# Altium schematic sheet fpga_sch.SchDoc: SoPC Oscilloscope - FPGA, Buffers
size C; Author: Santiago Navonne; DrawnBy: Santiago Navonne; Revision: 1.1; SheetNumber: 1; SheetTotal: 5
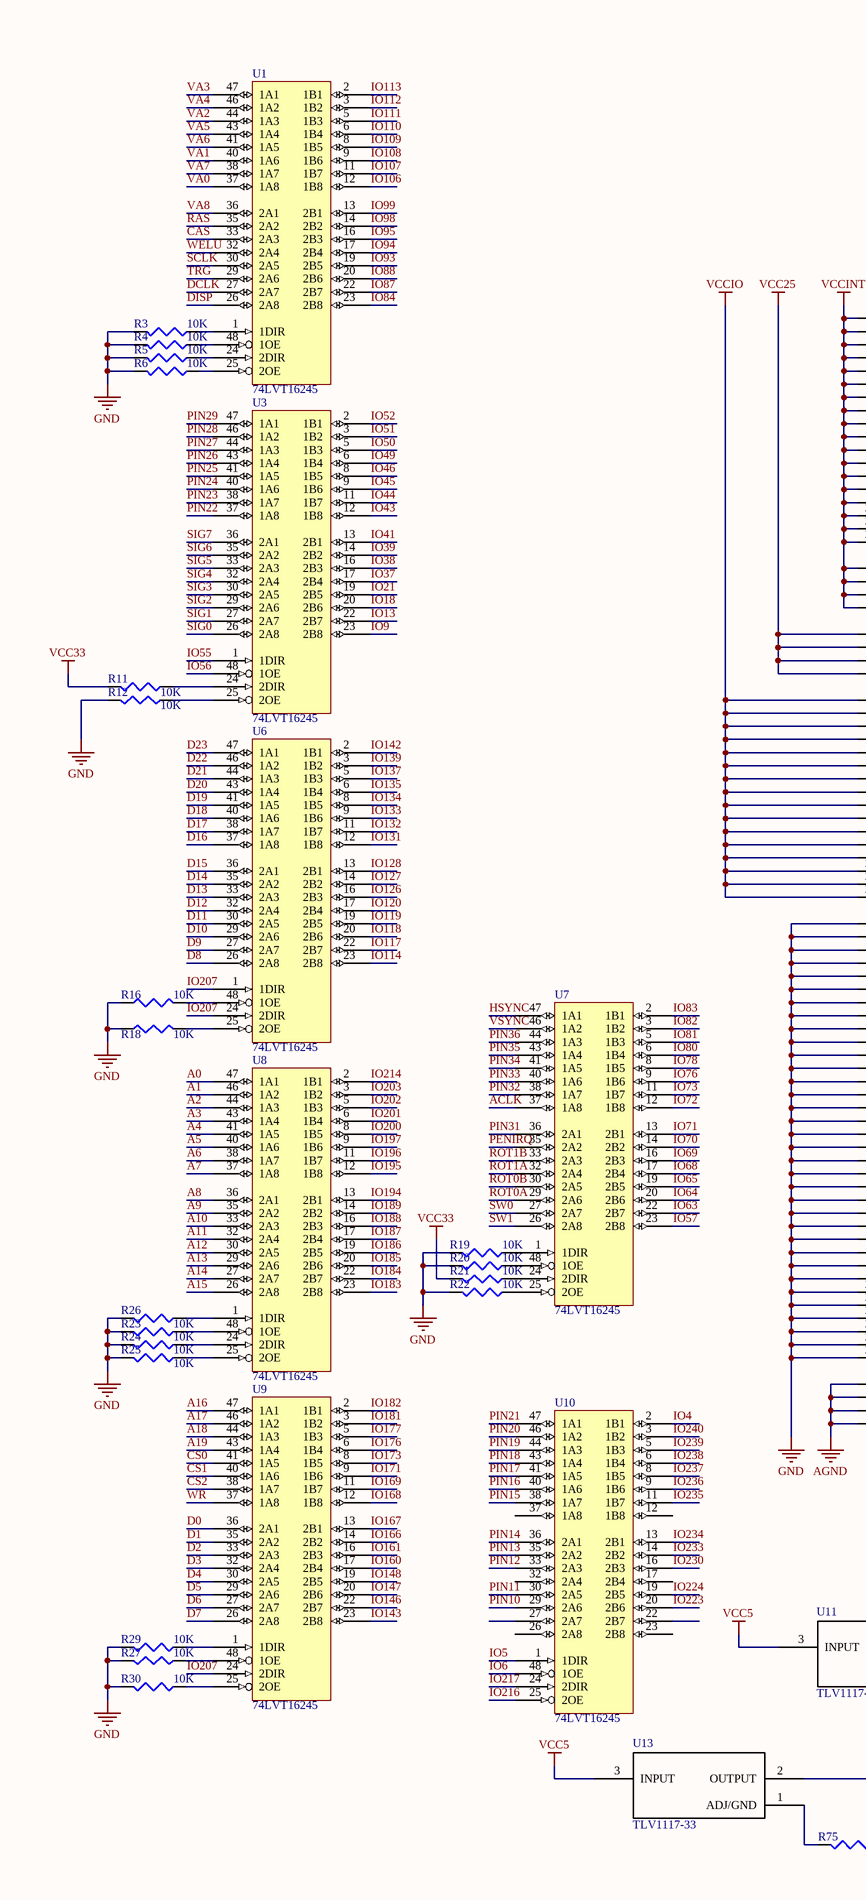
[diagram p0: fpga_sch.SchDoc, left]
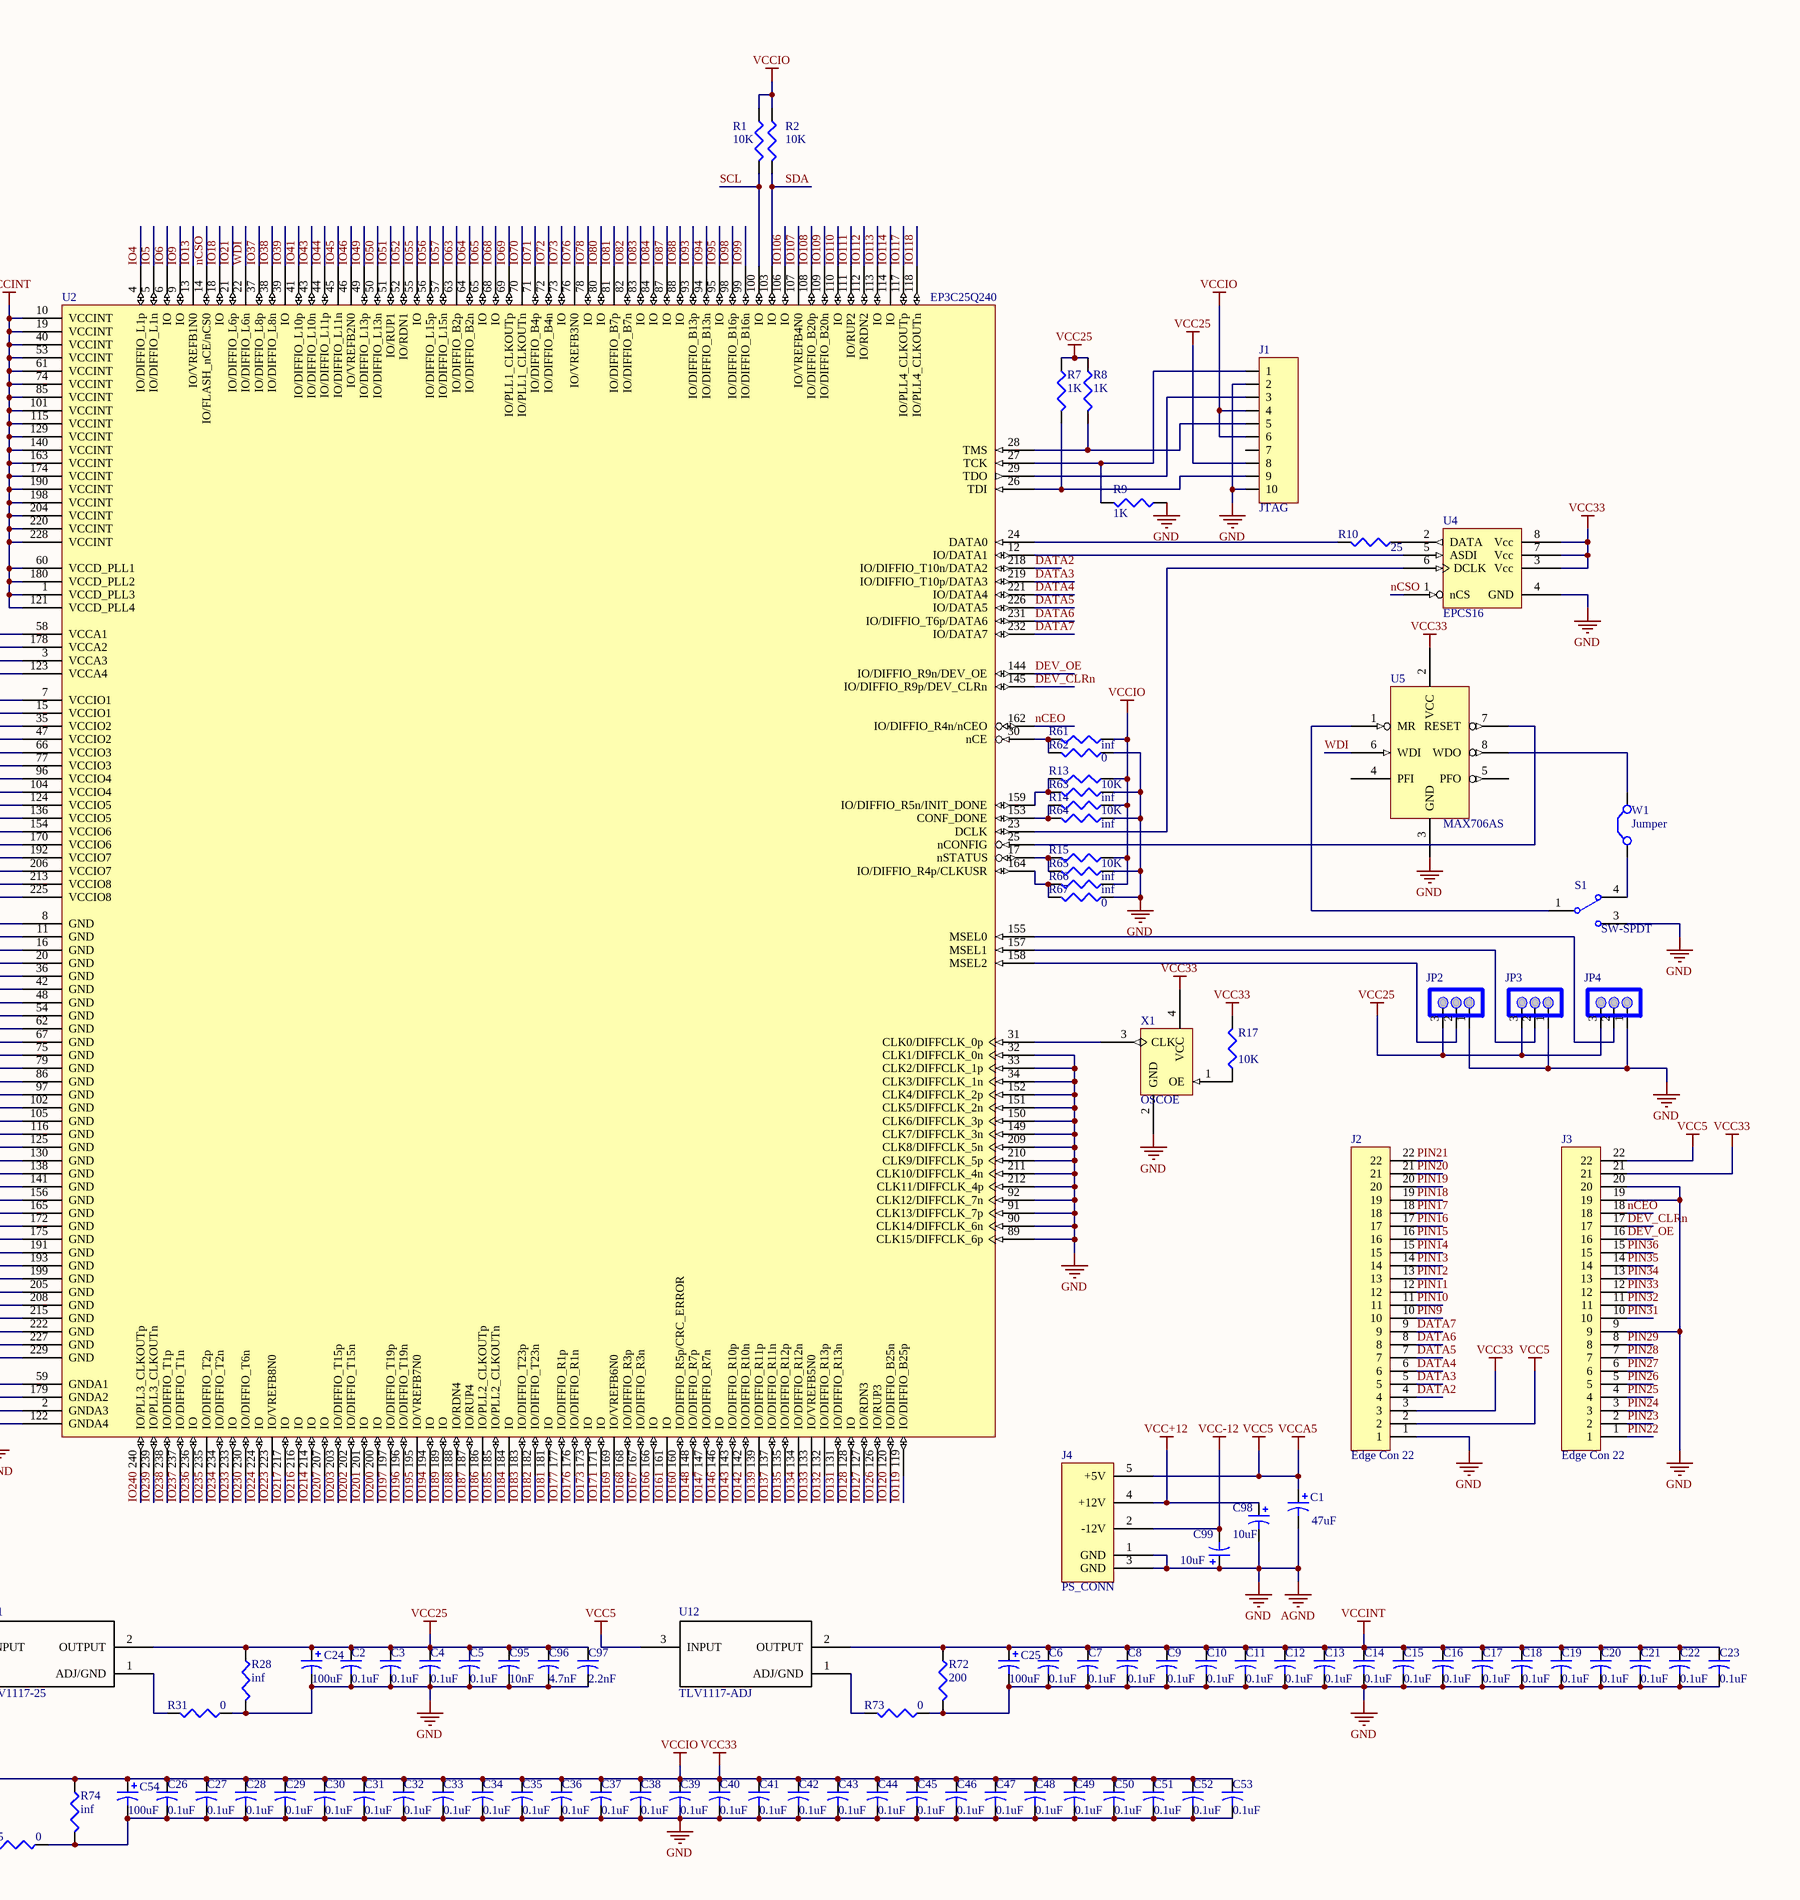
[diagram p1: fpga_sch.SchDoc, right]

## Parts
C1  value 47uF  [CAPC3216N]  (hidden comment: Cap Pol1)
C2  value 0.1uF  [CAPC1608L]  (hidden comment: Cap2)
C3  value 0.1uF  [CAPC1608L]  (hidden comment: Cap2)
C4  value 0.1uF  [CAPC1608L]  (hidden comment: Cap2)
C5  value 0.1uF  [CAPC1608L]  (hidden comment: Cap2)
C6  value 0.1uF  [CAPC1608L]  (hidden comment: Cap2)
C7  value 0.1uF  [CAPC1608L]  (hidden comment: Cap2)
C8  value 0.1uF  [CAPC1608L]  (hidden comment: Cap2)
C9  value 0.1uF  [CAPC1608L]  (hidden comment: Cap2)
C10  value 0.1uF  [CAPC1608L]  (hidden comment: Cap2)
C11  value 0.1uF  [CAPC1608L]  (hidden comment: Cap2)
C12  value 0.1uF  [CAPC1608L]  (hidden comment: Cap2)
C13  value 0.1uF  [CAPC1608L]  (hidden comment: Cap2)
C14  value 0.1uF  [CAPC1608L]  (hidden comment: Cap2)
C15  value 0.1uF  [CAPC1608L]  (hidden comment: Cap2)
C16  value 0.1uF  [CAPC1608L]  (hidden comment: Cap2)
C17  value 0.1uF  [CAPC1608L]  (hidden comment: Cap2)
C18  value 0.1uF  [CAPC1608L]  (hidden comment: Cap2)
C19  value 0.1uF  [CAPC1608L]  (hidden comment: Cap2)
C20  value 0.1uF  [CAPC1608L]  (hidden comment: Cap2)
C21  value 0.1uF  [CAPC1608L]  (hidden comment: Cap2)
C22  value 0.1uF  [CAPC1608L]  (hidden comment: Cap2)
C23  value 0.1uF  [CAPC1608L]  (hidden comment: Cap2)
C24  value 100uF  [C2917]  (hidden comment: Cap Pol3)
C25  value 100uF  [C2917]  (hidden comment: Cap Pol3)
C26  value 0.1uF  [CAPC1608L]  (hidden comment: Cap2)
C27  value 0.1uF  [CAPC1608L]  (hidden comment: Cap2)
C28  value 0.1uF  [CAPC1608L]  (hidden comment: Cap2)
C29  value 0.1uF  [CAPC1608L]  (hidden comment: Cap2)
C30  value 0.1uF  [CAPC1608L]  (hidden comment: Cap2)
C31  value 0.1uF  [CAPC1608L]  (hidden comment: Cap2)
C32  value 0.1uF  [CAPC1608L]  (hidden comment: Cap2)
C33  value 0.1uF  [CAPC1608L]  (hidden comment: Cap2)
C34  value 0.1uF  [CAPC1608L]  (hidden comment: Cap2)
C35  value 0.1uF  [CAPC1608L]  (hidden comment: Cap2)
C36  value 0.1uF  [CAPC1608L]  (hidden comment: Cap2)
C37  value 0.1uF  [CAPC1608L]  (hidden comment: Cap2)
C38  value 0.1uF  [CAPC1608L]  (hidden comment: Cap2)
C39  value 0.1uF  [CAPC1608L]  (hidden comment: Cap2)
C40  value 0.1uF  [CAPC1608L]  (hidden comment: Cap2)
C41  value 0.1uF  [CAPC1608L]  (hidden comment: Cap2)
C42  value 0.1uF  [CAPC1608L]  (hidden comment: Cap2)
C43  value 0.1uF  [CAPC1608L]  (hidden comment: Cap2)
C44  value 0.1uF  [CAPC1608L]  (hidden comment: Cap2)
C45  value 0.1uF  [CAPC1608L]  (hidden comment: Cap2)
C46  value 0.1uF  [CAPC1608L]  (hidden comment: Cap2)
C47  value 0.1uF  [CAPC1608L]  (hidden comment: Cap2)
C48  value 0.1uF  [CAPC1608L]  (hidden comment: Cap2)
C49  value 0.1uF  [CAPC1608L]  (hidden comment: Cap2)
C50  value 0.1uF  [CAPC1608L]  (hidden comment: Cap2)
C51  value 0.1uF  [CAPC1608L]  (hidden comment: Cap2)
C52  value 0.1uF  [CAPC1608L]  (hidden comment: Cap2)
C53  value 0.1uF  [CAPC1608L]  (hidden comment: Cap2)
C54  value 100uF  [C2917]  (hidden comment: Cap Pol3)
C95  value 10nF  [CAPC1608L]  (hidden comment: Cap2)
C96  value 4.7nF  [CAPC1608L]  (hidden comment: Cap2)
C97  value 2.2nF  [CAPC1608L]  (hidden comment: Cap2)
C98  value 10uF  [CAPC3216N]  (hidden comment: Cap Pol1)
C99  value 10uF  [CAPC3216N]  (hidden comment: Cap Pol1)
J1  JTAG  [SIP2X5]
J2  Edge Con 22  [PIN22]
J3  Edge Con 22  [PIN22]
J4  PS_CONN  [DIN5]
JP2  MSEL2  [HDR1X3]  (value not drawn)
JP3  MSEL1  [HDR1X3]  (value not drawn)
JP4  MSEL0  [HDR1X3]  (value not drawn)
R1  value 10K  [RESC1608N]  (hidden comment: Res3)
R2  value 10K  [RESC1608N]  (hidden comment: Res3)
R3  value 10K  [RESC1608N]  (hidden comment: Res3)
R4  value 10K  [RESC1608N]  (hidden comment: Res3)
R5  value 10K  [RESC1608N]  (hidden comment: Res3)
R6  value 10K  [RESC1608N]  (hidden comment: Res3)
R7  value 1K  [RESC1608N]  (hidden comment: Res3)
R8  value 1K  [RESC1608N]  (hidden comment: Res3)
R9  value 1K  [RESC1608N]  (hidden comment: Res3)
R10  value 25  [RESC1608N]  (hidden comment: Res3)
R11  value 10K  [RESC1608N]  (hidden comment: Res3)
R12  value 10K  [RESC1608N]  (hidden comment: Res3)
R13  value 10K  [RESC1608N]  (hidden comment: Res3)
R14  value 10K  [RESC1608N]  (hidden comment: Res3)
R15  value 10K  [RESC1608N]  (hidden comment: Res3)
R16  value 10K  [RESC1608N]  (hidden comment: Res3)
R17  value 10K  [RESC1608N]  (hidden comment: Res3)
R18  value 10K  [RESC1608N]  (hidden comment: Res3)
R19  value 10K  [RESC1608N]  (hidden comment: Res3)
R20  value 10K  [RESC1608N]  (hidden comment: Res3)
R21  value 10K  [RESC1608N]  (hidden comment: Res3)
R22  value 10K  [RESC1608N]  (hidden comment: Res3)
R23  value 10K  [RESC1608N]  (hidden comment: Res3)
R24  value 10K  [RESC1608N]  (hidden comment: Res3)
R25  value 10K  [RESC1608N]  (hidden comment: Res3)
R26  value 10K  [RESC1608N]  (hidden comment: Res3)
R27  value 10K  [RESC1608N]  (hidden comment: Res3)
R28  value inf  [RESC1608N]  (hidden comment: Res3)
R29  value 10K  [RESC1608N]  (hidden comment: Res3)
R30  value 10K  [RESC1608N]  (hidden comment: Res3)
R31  value 0  [RESC1608N]  (hidden comment: Res3)
R61  value inf  [RESC1608N]  (hidden comment: Res3)
R62  value 0  [RESC1608N]  (hidden comment: Res3)
R63  value inf  [RESC1608N]  (hidden comment: Res3)
R64  value inf  [RESC1608N]  (hidden comment: Res3)
R65  value inf  [RESC1608N]  (hidden comment: Res3)
R66  value inf  [RESC1608N]  (hidden comment: Res3)
R67  value 0  [RESC1608N]  (hidden comment: Res3)
R72  value 200  [RESC1608N]  (hidden comment: Res3)
R73  value 0  [RESC1608N]  (hidden comment: Res3)
R74  value inf  [RESC1608N]  (hidden comment: Res3)
R75  value 0  [RESC1608N]  (hidden comment: Res3)
S1  SW-SPDT  [SPDT]
U1  74LVT16245  [TSSOP48]
U2  EP3C25Q240  [PQFP240]
U3  74LVT16245  [TSSOP48]
U4  EPCS16  [SO-8]
U5  MAX706AS  [DIP8]
U6  74LVT16245  [TSSOP48]
U7  74LVT16245  [TSSOP48]
U8  74LVT16245  [TSSOP48]
U9  74LVT16245  [TSSOP48]
U10  74LVT16245  [TSSOP48]
U11  TLV1117-25  [KVU3]
U12  TLV1117-ADJ  [KVU3]
U13  TLV1117-33  [KVU3]
W1  Jumper  [SIP2]
X1  OSCOE  [SG636PCE]

## Nets
AGND: C1.2 C2.2 C3.2 C4.2 C5.2 C6.2 C7.2 C8.2 C9.2 C10.2 C11.2 C12.2 C13.2 C14.2 C15.2 C16.2 C17.2 C18.2 C19.2 C20.2 C21.2 C22.2 C23.2 C24.2 C25.2 C26.2 C27.2 C28.2 C29.2 C30.2 C31.2 C32.2 C33.2 C34.2 C35.2 C36.2 C37.2 C38.2 C39.2 C40.2 C41.2 C42.2 C43.2 C44.2 C45.2 C46.2 C47.2 C48.2 C49.2 C50.2 C51.2 C52.2 C53.2 C54.2 C95.2 C96.2 C97.2 C98.2 C99.1 J1.2 J1.10 J2.1 J3.9 J3.19 J3.20 J4.1(GND) J4.3(GND) JP2.1(J1) JP3.1(J1) JP4.1(J1) R3.2 R4.2 R5.2 R6.2 R9.1 R12.2 R16.1 R18.1 R19.2 R20.2 R22.2 R23.2 R24.2 R25.2 R26.2 R27.2 R28.2 R29.2 R30.2 R31.1 R62.1 R63.1 R64.1 R65.1 R67.1 R72.2 R73.1 R74.2 R75.1 S1.3 U1.4(GND) U1.10(GND) U1.15(GND) U1.21(GND) U1.28(GND) U1.34(GND) U1.39(GND) U1.45(GND) U2.2(GNDA3) U2.8(GND) U2.11(GND) U2.16(GND) U2.20(GND) U2.32(CLK1/DIFFCLK_0n) U2.33(CLK2/DIFFCLK_1p) U2.34(CLK3/DIFFCLK_1n) U2.36(GND) U2.42(GND) U2.48(GND) U2.54(GND) U2.59(GNDA1) U2.62(GND) U2.67(GND) U2.75(GND) U2.79(GND) U2.86(GND) U2.89(CLK15/DIFFCLK_6p) U2.90(CLK14/DIFFCLK_6n) U2.91(CLK13/DIFFCLK_7p) U2.92(CLK12/DIFFCLK_7n) U2.97(GND) U2.102(GND) U2.105(GND) U2.116(GND) U2.122(GNDA4) U2.125(GND) U2.130(GND) U2.138(GND) U2.141(GND) U2.149(CLK7/DIFFCLK_3n) U2.150(CLK6/DIFFCLK_3p) U2.151(CLK5/DIFFCLK_2n) U2.152(CLK4/DIFFCLK_2p) U2.156(GND) U2.165(GND) U2.172(GND) U2.175(GND) U2.179(GNDA2) U2.191(GND) U2.193(GND) U2.199(GND) U2.205(GND) U2.208(GND) U2.209(CLK8/DIFFCLK_5n) U2.210(CLK9/DIFFCLK_5p) U2.211(CLK10/DIFFCLK_4n) U2.212(CLK11/DIFFCLK_4p) U2.215(GND) U2.222(GND) U2.227(GND) U2.229(GND) U3.4(GND) U3.10(GND) U3.15(GND) U3.21(GND) U3.28(GND) U3.34(GND) U3.39(GND) U3.45(GND) U4.4(GND) U5.3(GND) U6.4(GND) U6.10(GND) U6.15(GND) U6.21(GND) U6.28(GND) U6.34(GND) U6.39(GND) U6.45(GND) U7.4(GND) U7.10(GND) U7.15(GND) U7.21(GND) U7.28(GND) U7.34(GND) U7.39(GND) U7.45(GND) U8.4(GND) U8.10(GND) U8.15(GND) U8.21(GND) U8.28(GND) U8.34(GND) U8.39(GND) U8.45(GND) U9.4(GND) U9.10(GND) U9.15(GND) U9.21(GND) U9.28(GND) U9.34(GND) U9.39(GND) U9.45(GND) U10.4(GND) U10.10(GND) U10.15(GND) U10.21(GND) U10.28(GND) U10.34(GND) U10.39(GND) U10.45(GND) X1.2(GND)  [also labelled GND]
VCC: C26.1 C27.1 C28.1 C29.1 C30.1 C31.1 C32.1 C33.1 C34.1 C35.1 C36.1 C37.1 C38.1 C39.1 C40.1 C41.1 C42.1 C43.1 C44.1 C45.1 C46.1 C47.1 C48.1 C49.1 C50.1 C51.1 C52.1 C53.1 C54.1 J1.4 J1.6 J2.3 J3.21 R1.1 R2.1 R11.2 R13.1 R14.1 R15.1 R17.2 R21.2 R61.1 R66.1 R74.1 U1.7(Vcc33) U1.18(Vcc33) U1.31(Vcc33) U1.42(Vcc33) U2.7(VCCIO1) U2.15(VCCIO1) U2.35(VCCIO2) U2.47(VCCIO2) U2.66(VCCIO3) U2.77(VCCIO3) U2.96(VCCIO4) U2.104(VCCIO4) U2.124(VCCIO5) U2.136(VCCIO5) U2.154(VCCIO6) U2.170(VCCIO6) U2.192(VCCIO7) U2.206(VCCIO7) U2.213(VCCIO8) U2.225(VCCIO8) U3.7(Vcc33) U3.18(Vcc33) U3.31(Vcc33) U3.42(Vcc33) U4.3(Vcc) U4.7(Vcc) U4.8(Vcc) U5.2(VCC) U6.7(Vcc33) U6.18(Vcc33) U6.31(Vcc33) U6.42(Vcc33) U7.7(Vcc33) U7.18(Vcc33) U7.31(Vcc33) U7.42(Vcc33) U8.7(Vcc33) U8.18(Vcc33) U8.31(Vcc33) U8.42(Vcc33) U9.7(Vcc33) U9.18(Vcc33) U9.31(Vcc33) U9.42(Vcc33) U10.7(Vcc33) U10.18(Vcc33) U10.31(Vcc33) U10.42(Vcc33) U13.2(OUTPUT) X1.4(VCC)  [also labelled VCC33, VCCIO]
VCC5: C1.1 J2.2 J3.22 J4.5(+5V) U11.3(INPUT) U12.3(INPUT) U13.3(INPUT)  [also labelled VCCA5]
VCC25: C2.1 C3.1 C4.1 C5.1 C24.1 C95.1 C96.1 C97.1 J1.8 JP2.3(J3) JP3.3(J3) JP4.3(J3) R7.1 R8.1 R28.1 U2.3(VCCA3) U2.58(VCCA1) U2.123(VCCA4) U2.178(VCCA2) U11.2(OUTPUT)
VCC+12: C98.1 J4.4(+12V)
VCC-12: C99.2 J4.2(-12V)
VCCINT: C6.1 C7.1 C8.1 C9.1 C10.1 C11.1 C12.1 C13.1 C14.1 C15.1 C16.1 C17.1 C18.1 C19.1 C20.1 C21.1 C22.1 C23.1 C25.1 R72.1 U2.1(VCCD_PLL3) U2.10(VCCINT) U2.19(VCCINT) U2.40(VCCINT) U2.53(VCCINT) U2.60(VCCD_PLL1) U2.61(VCCINT) U2.74(VCCINT) U2.85(VCCINT) U2.101(VCCINT) U2.115(VCCINT) U2.121(VCCD_PLL4) U2.129(VCCINT) U2.140(VCCINT) U2.163(VCCINT) U2.174(VCCINT) U2.180(VCCD_PLL2) U2.190(VCCINT) U2.198(VCCINT) U2.204(VCCINT) U2.220(VCCINT) U2.228(VCCINT) U12.2(OUTPUT)
A0: U8.47(1A1)
A1: U8.46(1A2)
A2: U8.44(1A3)
A3: U8.43(1A4)
A4: U8.41(1A5)
A5: U8.40(1A6)
A6: U8.38(1A7)
A7: U8.37(1A8)
A8: U8.36(2A1)
A9: U8.35(2A2)
A10: U8.33(2A3)
A11: U8.32(2A4)
A12: U8.30(2A5)
A13: U8.29(2A6)
A14: U8.27(2A7)
A15: U8.26(2A8)
A16: U9.47(1A1)
A17: U9.46(1A2)
A18: U9.44(1A3)
A19: U9.43(1A4)
ACLK: U7.37(1A8)
CAS: U1.33(2A3)
CS0: U9.41(1A5)
CS1: U9.40(1A6)
CS2: U9.38(1A7)
D0: U9.36(2A1)
D1: U9.35(2A2)
D2: U9.33(2A3)
D3: U9.32(2A4)
D4: U9.30(2A5)
D5: U9.29(2A6)
D6: U9.27(2A7)
D7: U9.26(2A8)
D8: U6.26(2A8)
D9: U6.27(2A7)
D10: U6.29(2A6)
D11: U6.30(2A5)
D12: U6.32(2A4)
D13: U6.33(2A3)
D14: U6.35(2A2)
D15: U6.36(2A1)
D16: U6.37(1A8)
D17: U6.38(1A7)
D18: U6.40(1A6)
D19: U6.41(1A5)
D20: U6.43(1A4)
D21: U6.44(1A3)
D22: U6.46(1A2)
D23: U6.47(1A1)
DATA2: J2.4 U2.218(IO/DIFFIO_T10n/DATA2)
DATA3: J2.5 U2.219(IO/DIFFIO_T10p/DATA3)
DATA4: J2.6 U2.221(IO/DATA4)
DATA5: J2.7 U2.226(IO/DATA5)
DATA6: J2.8 U2.231(IO/DIFFIO_T6p/DATA6)
DATA7: J2.9 U2.232(IO/DATA7)
DCLK: U1.27(2A7)
DEV_CLRn: J3.17 U2.145(IO/DIFFIO_R9p/DEV_CLRn)
DEV_OE: J3.16 U2.144(IO/DIFFIO_R9n/DEV_OE)
DISP: U1.26(2A8)
HSYNC: U7.47(1A1)
IO4: U2.4(IO/DIFFIO_L1p) U10.2(1B1)
IO5: U2.5(IO/DIFFIO_L1n) U10.1(1DIR)
IO6: U2.6(IO) U10.48(1OE)
IO9: U2.9(IO) U3.23(2B8)
IO13: U2.13(IO/VREFB1N0) U3.22(2B7)
IO18: U2.18(IO) U3.20(2B6)
IO21: U2.21(IO/DIFFIO_L6p) U3.19(2B5)
IO37: U2.37(IO/DIFFIO_L8p) U3.17(2B4)
IO38: U2.38(IO/DIFFIO_L8n) U3.16(2B3)
IO39: U2.39(IO) U3.14(2B2)
IO41: U2.41(IO/DIFFIO_L10p) U3.13(2B1)
IO43: U2.43(IO/DIFFIO_L10n) U3.12(1B8)
IO44: U2.44(IO/DIFFIO_L11p) U3.11(1B7)
IO45: U2.45(IO/DIFFIO_L11n) U3.9(1B6)
IO46: U2.46(IO/VREFB2N0) U3.8(1B5)
IO49: U2.49(IO/DIFFIO_L13p) U3.6(1B4)
IO50: U2.50(IO/DIFFIO_L13n) U3.5(1B3)
IO51: U2.51(IO/RUP1) U3.3(1B2)
IO52: U2.52(IO/RDN1) U3.2(1B1)
IO55: U2.55(IO) U3.1(1DIR)
IO56: U2.56(IO/DIFFIO_L15p) U3.48(1OE)
IO57: U2.57(IO/DIFFIO_L15n) U7.23(2B8)
IO63: U2.63(IO/DIFFIO_B2p) U7.22(2B7)
IO64: U2.64(IO/DIFFIO_B2n) U7.20(2B6)
IO65: U2.65(IO) U7.19(2B5)
IO68: U2.68(IO) U7.17(2B4)
IO69: U2.69(IO/PLL1_CLKOUTp) U7.16(2B3)
IO70: U2.70(IO/PLL1_CLKOUTn) U7.14(2B2)
IO71: U2.71(IO/DIFFIO_B4p) U7.13(2B1)
IO72: U2.72(IO/DIFFIO_B4n) U7.12(1B8)
IO73: U2.73(IO) U7.11(1B7)
IO76: U2.76(IO/VREFB3N0) U7.9(1B6)
IO78: U2.78(IO) U7.8(1B5)
IO80: U2.80(IO) U7.6(1B4)
IO81: U2.81(IO/DIFFIO_B7p) U7.5(1B3)
IO82: U2.82(IO/DIFFIO_B7n) U7.3(1B2)
IO83: U2.83(IO) U7.2(1B1)
IO84: U1.23(2B8) U2.84(IO)
IO87: U1.22(2B7) U2.87(IO)
IO88: U1.20(2B6) U2.88(IO)
IO93: U1.19(2B5) U2.93(IO/DIFFIO_B13p)
IO94: U1.17(2B4) U2.94(IO/DIFFIO_B13n)
IO95: U1.16(2B3) U2.95(IO)
IO98: U1.14(2B2) U2.98(IO/DIFFIO_B16p)
IO99: U1.13(2B1) U2.99(IO/DIFFIO_B16n)
IO106: U1.12(1B8) U2.106(IO)
IO107: U1.11(1B7) U2.107(IO/VREFB4N0)
IO108: U1.9(1B6) U2.108(IO/DIFFIO_B20p)
IO109: U1.8(1B5) U2.109(IO/DIFFIO_B20n)
IO110: U1.6(1B4) U2.110(IO)
IO111: U1.5(1B3) U2.111(IO/RUP2)
IO112: U1.3(1B2) U2.112(IO/RDN2)
IO113: U1.2(1B1) U2.113(IO)
IO114: U2.114(IO) U6.23(2B8)
IO117: U2.117(IO/PLL4_CLKOUTp) U6.22(2B7)
IO118: U2.118(IO/PLL4_CLKOUTn) U6.20(2B6)
IO119: U2.119(IO/DIFFIO_B25p) U6.19(2B5)
IO120: U2.120(IO/DIFFIO_B25n) U6.17(2B4)
IO126: U2.126(IO/RUP3) U6.16(2B3)
IO127: U2.127(IO/RDN3) U6.14(2B2)
IO128: U2.128(IO) U6.13(2B1)
IO131: U2.131(IO/DIFFIO_R13n) U6.12(1B8)
IO132: U2.132(IO/DIFFIO_R13p) U6.11(1B7)
IO133: U2.133(IO/VREFB5N0) U6.9(1B6)
IO134: U2.134(IO/DIFFIO_R12n) U6.8(1B5)
IO135: U2.135(IO/DIFFIO_R12p) U6.6(1B4)
IO137: U2.137(IO/DIFFIO_R11n) U6.5(1B3)
IO139: U2.139(IO/DIFFIO_R11p) U6.3(1B2)
IO142: U2.142(IO/DIFFIO_R10n) U6.2(1B1)
IO143: U2.143(IO/DIFFIO_R10p) U9.23(2B8)
IO146: U2.146(IO) U9.22(2B7)
IO147: U2.147(IO/DIFFIO_R7n) U9.20(2B6)
IO148: U2.148(IO/DIFFIO_R7p) U9.19(2B5)
IO160: U2.160(IO/DIFFIO_R5p/CRC_ERROR) U9.17(2B4)
IO161: U2.161(IO) U9.16(2B3)
IO166: U2.166(IO) U9.14(2B2)
IO167: U2.167(IO/DIFFIO_R3n) U9.13(2B1)
IO168: U2.168(IO/DIFFIO_R3p) U9.12(1B8)
IO169: U2.169(IO/VREFB6N0) U9.11(1B7)
IO171: U2.171(IO) U9.9(1B6)
IO173: U2.173(IO) U9.8(1B5)
IO176: U2.176(IO/DIFFIO_R1n) U9.6(1B4)
IO177: U2.177(IO/DIFFIO_R1p) U9.5(1B3)
IO181: U2.181(IO) U9.3(1B2)
IO182: U2.182(IO/DIFFIO_T23n) U9.2(1B1)
IO183: U2.183(IO/DIFFIO_T23p) U8.23(2B8)
IO184: U2.184(IO) U8.22(2B7)
IO185: U2.185(IO/PLL2_CLKOUTn) U8.20(2B6)
IO186: U2.186(IO/PLL2_CLKOUTp) U8.19(2B5)
IO187: U2.187(IO/RUP4) U8.17(2B4)
IO188: U2.188(IO/RDN4) U8.16(2B3)
IO189: U2.189(IO) U8.14(2B2)
IO194: U2.194(IO) U8.13(2B1)
IO195: U2.195(IO/VREFB7N0) U8.12(1B8)
IO196: U2.196(IO/DIFFIO_T19n) U8.11(1B7)
IO197: U2.197(IO/DIFFIO_T19p) U8.9(1B6)
IO200: U2.200(IO) U8.8(1B5)
IO201: U2.201(IO) U8.6(1B4)
IO202: U2.202(IO/DIFFIO_T15n) U8.5(1B3)
IO203: U2.203(IO/DIFFIO_T15p) U8.3(1B2)
IO207: U2.207(IO) U6.1(1DIR) U6.24(2DIR) U9.24(2DIR)
IO214: U2.214(IO) U8.2(1B1)
IO216: U2.216(IO) U10.25(2OE)
IO217: U2.217(IO) U10.24(2DIR)
IO223: U2.223(IO/VREFB8N0) U10.20(2B6)
IO224: U2.224(IO) U10.19(2B5)
IO230: U2.230(IO/DIFFIO_T6n) U10.16(2B3)
IO233: U2.233(IO) U10.14(2B2)
IO234: U2.234(IO/DIFFIO_T2n) U10.13(2B1)
IO235: U2.235(IO/DIFFIO_T2p) U10.11(1B7)
IO236: U2.236(IO) U10.9(1B6)
IO237: U2.237(IO/DIFFIO_T1n) U10.8(1B5)
IO238: U2.238(IO/DIFFIO_T1p) U10.6(1B4)
IO239: U2.239(IO/PLL3_CLKOUTn) U10.5(1B3)
IO240: U2.240(IO/PLL3_CLKOUTp) U10.3(1B2)
nCEO: J3.18 U2.162(IO/DIFFIO_R4n/nCEO)
nCSO: U2.14(IO/FLASH_nCE/nCS0) U4.1(nCS)
PENIRQ: U7.35(2A2)
PIN9: J2.10
PIN10: J2.11 U10.29(2A6)
PIN11: J2.12 U10.30(2A5)
PIN12: J2.13 U10.33(2A3)
PIN13: J2.14 U10.35(2A2)
PIN14: J2.15 U10.36(2A1)
PIN15: J2.16 U10.38(1A7)
PIN16: J2.17 U10.40(1A6)
PIN17: J2.18 U10.41(1A5)
PIN18: J2.19 U10.43(1A4)
PIN19: J2.20 U10.44(1A3)
PIN20: J2.21 U10.46(1A2)
PIN21: J2.22 U10.47(1A1)
PIN22: J3.1 U3.37(1A8)
PIN23: J3.2 U3.38(1A7)
PIN24: J3.3 U3.40(1A6)
PIN25: J3.4 U3.41(1A5)
PIN26: J3.5 U3.43(1A4)
PIN27: J3.6 U3.44(1A3)
PIN28: J3.7 U3.46(1A2)
PIN29: J3.8 U3.47(1A1)
PIN31: J3.10 U7.36(2A1)
PIN32: J3.11 U7.38(1A7)
PIN33: J3.12 U7.40(1A6)
PIN34: J3.13 U7.41(1A5)
PIN35: J3.14 U7.43(1A4)
PIN36: J3.15 U7.44(1A3)
RAS: U1.35(2A2)
ROT0A: U7.29(2A6)
ROT0B: U7.30(2A5)
ROT1A: U7.32(2A4)
ROT1B: U7.33(2A3)
SCL: R1.2 U2.100(IO)
SCLK: U1.30(2A5)
SDA: R2.2 U2.103(IO)
SIG0: U3.26(2A8)
SIG1: U3.27(2A7)
SIG2: U3.29(2A6)
SIG3: U3.30(2A5)
SIG4: U3.32(2A4)
SIG5: U3.33(2A3)
SIG6: U3.35(2A2)
SIG7: U3.36(2A1)
SW0: U7.27(2A7)
SW1: U7.26(2A8)
TRG: U1.29(2A6)
VA0: U1.37(1A8)
VA1: U1.40(1A6)
VA2: U1.44(1A3)
VA3: U1.47(1A1)
VA4: U1.46(1A2)
VA5: U1.43(1A4)
VA6: U1.41(1A5)
VA7: U1.38(1A7)
VA8: U1.36(2A1)
VSYNC: U7.46(1A2)
WDI: U2.22(IO/DIFFIO_L6n) U5.6(WDI)
WELU: U1.32(2A4)
WR: U9.37(1A8)
NetJ1_1: J1.1 R9.2 U2.27(TCK)
NetJ1_3: J1.3 U2.29(TDO)
NetJ1_5: J1.5 R8.2 U2.28(TMS)
NetJ1_9: J1.9 R7.2 U2.26(TDI)
NetJP2_2: JP2.2(J2) U2.158(MSEL2)
NetJP3_2: JP3.2(J2) U2.157(MSEL1)
NetJP4_2: JP4.2(J2) U2.155(MSEL0)
NetR3_1: R3.1 U1.1(1DIR)
NetR4_1: R4.1 U1.48(1OE)
NetR5_1: R5.1 U1.24(2DIR)
NetR6_1: R6.1 U1.25(2OE)
NetR10_1: R10.1 U4.2(DATA)
NetR10_2: R10.2 U2.24(DATA0)
NetR11_1: R11.1 U3.24(2DIR)
NetR12_1: R12.1 U3.25(2OE)
NetR13_2: R13.2 R63.2 U2.159(IO/DIFFIO_R5n/INIT_DONE)
NetR14_2: R14.2 R64.2 U2.153(CONF_DONE)
NetR15_2: R15.2 R65.2 U2.17(nSTATUS)
NetR16_2: R16.2 U6.48(1OE)
NetR17_1: R17.1 X1.1(OE)
NetR18_2: R18.2 U6.25(2OE)
NetR19_1: R19.1 U7.1(1DIR)
NetR20_1: R20.1 U7.48(1OE)
NetR21_1: R21.1 U7.24(2DIR)
NetR22_1: R22.1 U7.25(2OE)
NetR23_1: R23.1 U8.48(1OE)
NetR24_1: R24.1 U8.24(2DIR)
NetR25_1: R25.1 U8.25(2OE)
NetR26_1: R26.1 U8.1(1DIR)
NetR27_1: R27.1 U9.48(1OE)
NetR29_1: R29.1 U9.1(1DIR)
NetR30_1: R30.1 U9.25(2OE)
NetR31_2: R31.2 U11.1(ADJ/GND)
NetR61_2: R61.2 R62.2 U2.30(nCE)
NetR66_2: R66.2 R67.2 U2.164(IO/DIFFIO_R4p/CLKUSR)
NetR73_2: R73.2 U12.1(ADJ/GND)
NetR75_2: R75.2 U13.1(ADJ/GND)
NetS1_1: S1.1 U5.1(MR)
NetS1_4: S1.4 W1.1(C1)
NetU2_12: U2.12(IO/DATA1) U4.5(ASDI)
NetU2_23: U2.23(DCLK) U4.6(DCLK)
NetU2_25: U2.25(nCONFIG) U5.7(RESET)
NetU2_31: U2.31(CLK0/DIFFCLK_0p) X1.3(CLK)
NetU5_8: U5.8(WDO) W1.2(C2)

Not connected (* = marked no-connect by the designer): J1 7; U5 4(PFI) 5(PFO); U10 12(1B8) 17(2B4) 22(2B7) 23(2B8) 26(2A8) 27(2A7) 32(2A4) 37(1A8)

## Library data of the parts
C1 C98 C99 = Cap Pol1: Polarized Capacitor; Published: 8-Jun-2000; LatestRevisionDate: 17-Jul-2002; LatestRevisionNote: Re-released for DXP Platform.; PackageReference: RB7.6-15; Publisher: Altium Limited; PackageDescription: Polarized Capacitor (Radial); 2 Leads
C2-C23 C26-C53 C95-C97 = Cap2: Capacitor; Published: 23-Sep-2002; PackageReference: CAPR5-4X5; Publisher: Altium Limited; PackageDescription: Capacitor; 2 Leads
C24 C25 C54 = Cap Pol3: Polarized Capacitor (Surface Mount); Published: 8-Jun-2000; LatestRevisionDate: 29-May-2009; LatestRevisionNote: IPC-7351 Footprint Added.; PackageReference: C0805; Publisher: Altium Limited; PackageDescription: Chip Capacitor
J1 = CON10
J2 J3 = Edge Con 22: 22-Pin Edge Connector; LatestRevisionDate: 17-Jul-2002; LatestRevisionNote: Re-released for DXP Platform.; Publisher: Altium Limited
J4 = PS_CONN: Elpac Compatible Power Supply Connector
JP2-JP4 = JUMPER3SM
R1-R31 R61-R67 R72-R75 = Res3: Resistor; Published: 8-Jun-2000; LatestRevisionDate: 29-May-2009; LatestRevisionNote: IPC-7351 Footprint Added.; PackageReference: J1-0603; Publisher: Altium Limited; PackageDescription: Chip Resistor
S1 = SW-SPDT: SPDT Subminiature Toggle Switch, Right Angle Mounting, Vertical Actuation; Published: 24-Mar-1999; LatestRevisionDate: 17-Dec-2003; LatestRevisionNote: Schematic revised, PCB Footprint replaced.; PackageReference: TL36WW15050; Publisher: Altium Limited; PackageDescription: Switch; 4 Leads; DatasheetVersion: 05-Dec-2000; ComponentLink1Description: Manufacturer Link; ComponentLink1URL: http://www.apem.com
U1 U3 U6-U10 = 74LVT16245: 16-Bit Bus Transceiver
U2 = EP3C25Q240: Cyclone III EP3C-25 FPGA PQFP240
U4 = EPCS1: Altera Serial Configuration Device
U5 = MAX705: Maxim uP Supervisory Circuit
U11 = TLV1117-25_KVU_3: Imported; Vendor: Texas Instruments; PACKAGE_DESIGNATOR: KVU; PIN_COUNT: 3; FAMILY_NAME: STANDARD VOLTAGE REGULATOR; INDUSTRY_STD_PKG_TYPE: PFM; Manufacturer_Part_Number: tlv1117-25_kvu_3; GENERIC_PART_NUMBER: TLV1117-25; Datasheet URL: http://www.ti.com/lit/gpn/TLV1117-25; Manufacturer: Texas Instruments; RefDes: RefDes; Type: DEV; Value: Value
U12 = TLV1117_KCS_3: Imported; Vendor: Texas Instruments; PACKAGE_DESIGNATOR: KCS; PIN_COUNT: 3; FAMILY_NAME: STANDARD VOLTAGE REGULATOR; INDUSTRY_STD_PKG_TYPE: TO-220; Manufacturer_Part_Number: tlv1117_kcs_3; GENERIC_PART_NUMBER: TLV1117; Datasheet URL: http://www.ti.com/lit/gpn/TLV1117; Manufacturer: Texas Instruments; RefDes: RefDes; Type: DEV; Value: Value
U13 = TLV1117-33_KVU_3: Imported; Vendor: Texas Instruments; PACKAGE_DESIGNATOR: KVU; PIN_COUNT: 3; FAMILY_NAME: STANDARD VOLTAGE REGULATOR; INDUSTRY_STD_PKG_TYPE: PFM; Manufacturer_Part_Number: tlv1117-33_kvu_3; GENERIC_PART_NUMBER: TLV1117-33; Datasheet URL: http://www.ti.com/lit/gpn/TLV1117-33; Manufacturer: Texas Instruments; RefDes: RefDes; Type: DEV; Value: Value
W1 = Jumper: Jumper Wire; Published: 24-Mar-1999; LatestRevisionDate: 17-Jul-2002; LatestRevisionNote: Re-released for DXP Platform.; PackageReference: RAD-0.2; Publisher: Altium Limited; PackageDescription: Radial Cap, Thru-Hole; 2 Leads; 0.2 in Pin Spacing
X1 = OSCOE: Oscillator with Active High Output Enable